# Altium schematic sheet 917S001(ZHTH-010)-F.SchDoc
size A3; PageSetup: Record=PageOptions|CenterHorizontal=True|CenterVertical=True|PrintScale=0.71|XCorrection=1.00|YCorrection=1.00|PrintKind=1|BorderSize=5000000|LeftOffset=0|BottomOffset=0|Orientation=2|PaperLength=1000|PaperWidth=1000|Scale=100|PaperSource=7|PrintQuality=300|MediaType=1|DitherType=10|PrintScaleMode=1|PaperKind=A4(210x297mm)
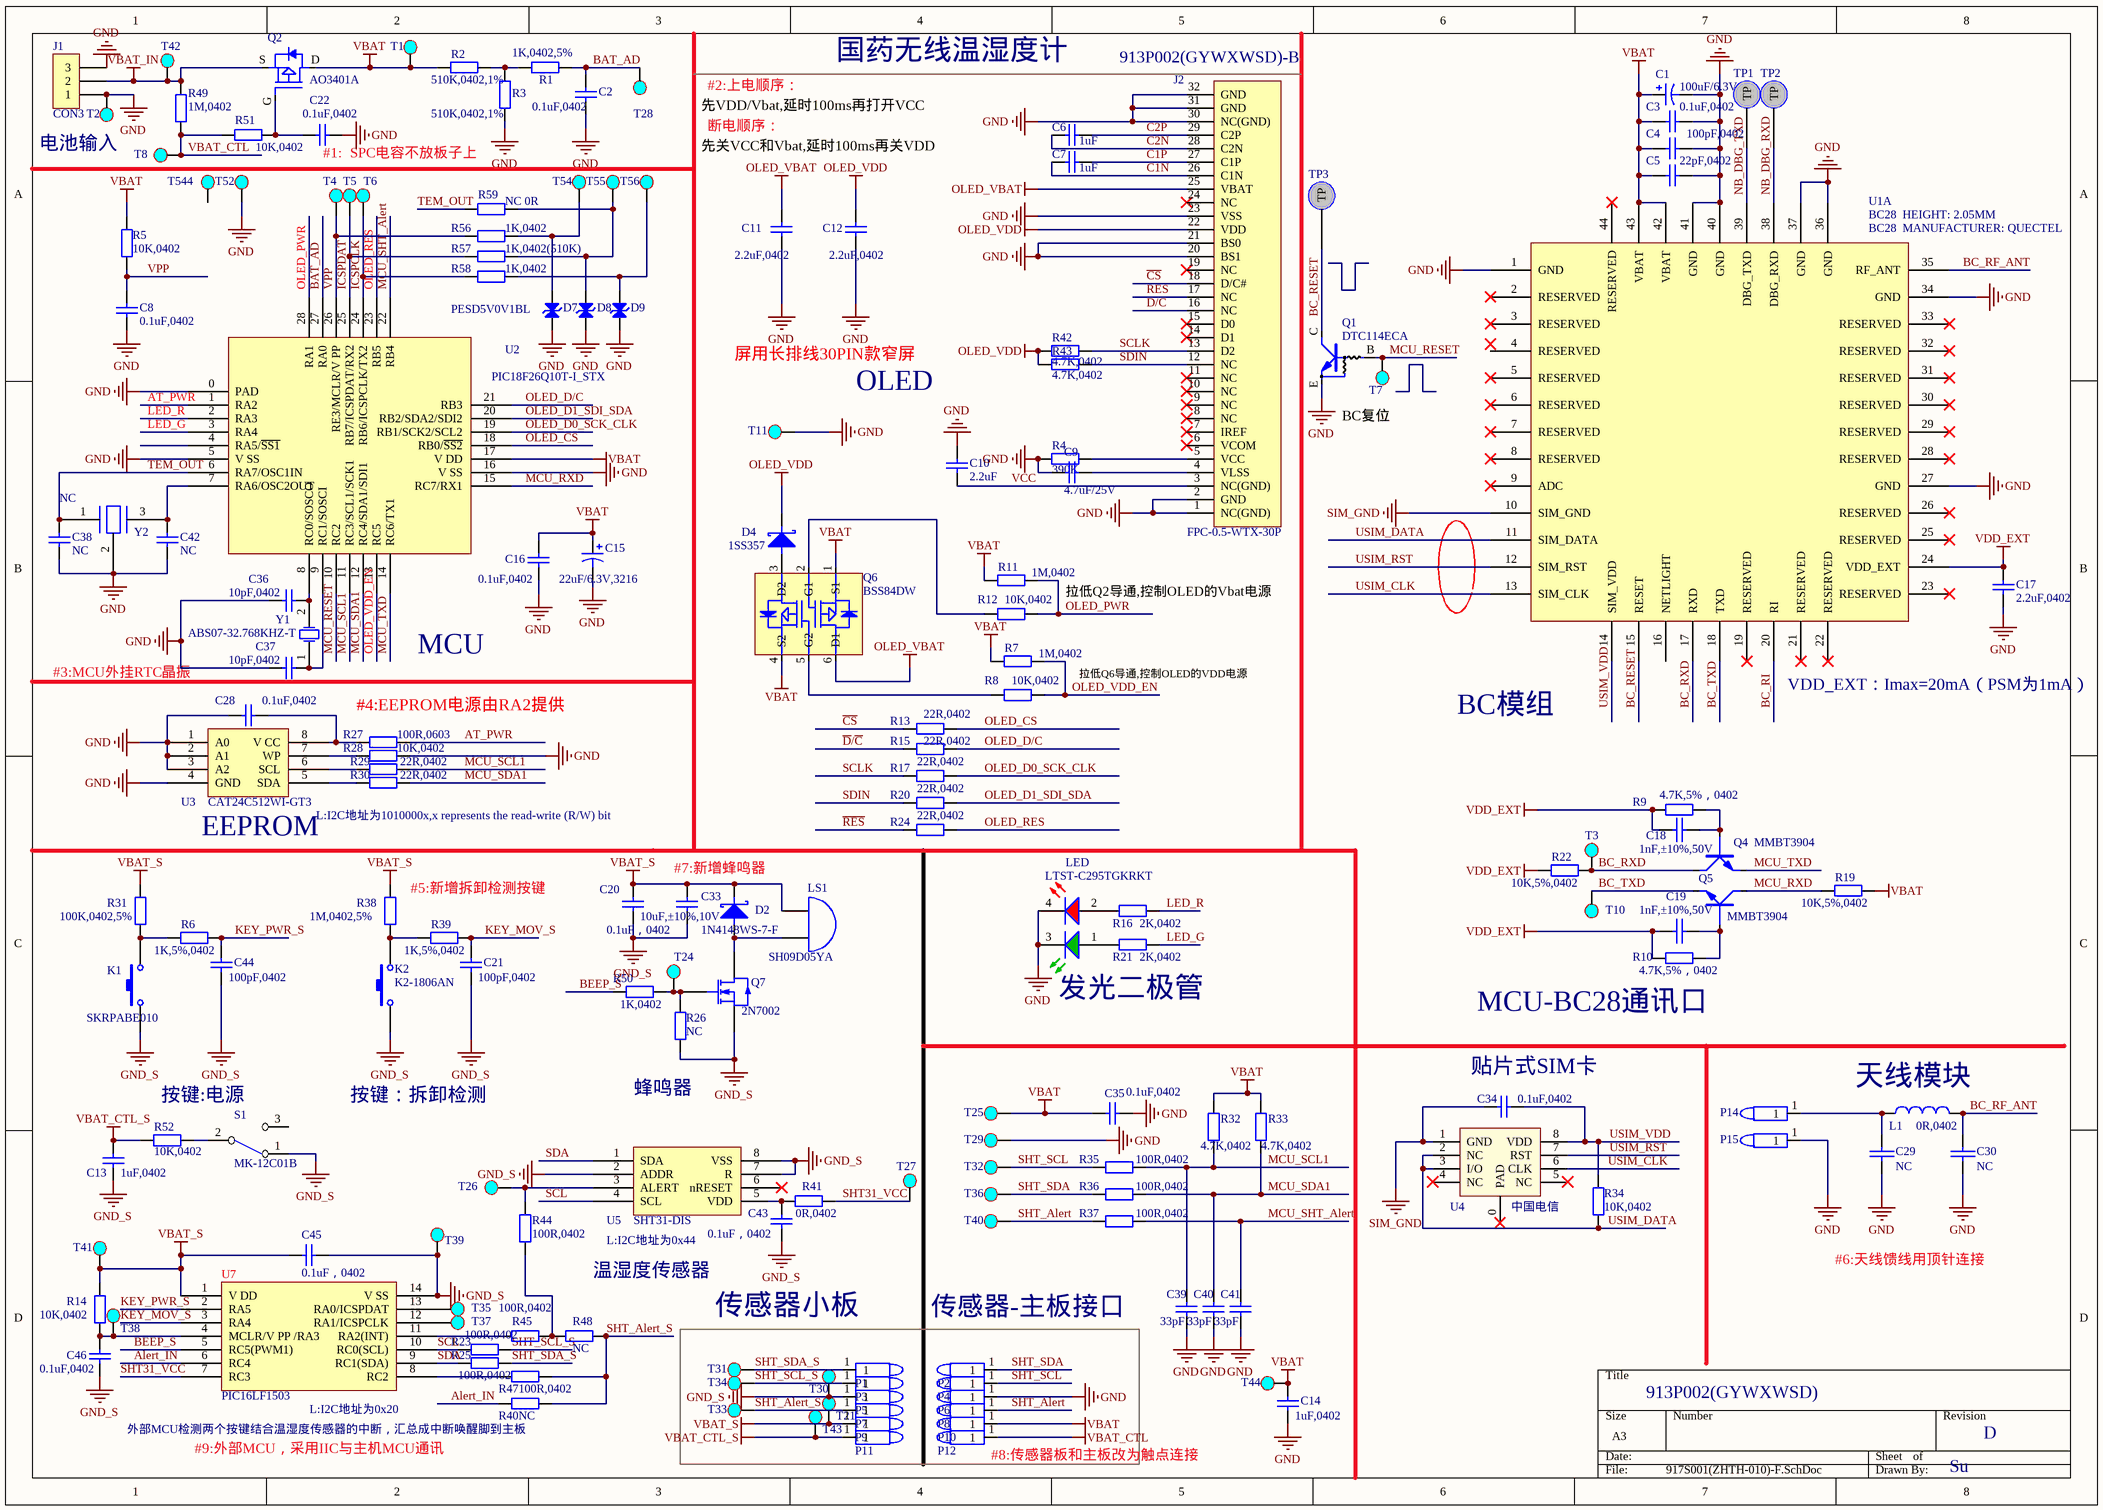
[diagram p0: 917S001(ZHTH-010)-F.SchDoc]

## Parts
C1  100uF/6.3V  [3528]
C2  0.1uF,0402  [0402]
C3  0.1uF,0402  [0402]
C4  100pF,0402  [0402]
C5  22pF,0402  [0402]
C6  1uF  [0402]
C7  1uF  [0402]
C8  0.1uF,0402  [0402]
C9  4.7uF/25V  [0805]
C10  2.2uF  [0402]
C11  2.2uF,0402  [0402]
C12  2.2uF,0402  [0402]
C13  1uF,0402  [0402]
C14  1uF,0402  [0402]
C15  22uF/6.3V,3216  [3216]
C16  0.1uF,0402  [0402]
C17  2.2uF,0402  [0402]
C18  1nF,±10%,50V  [0402]
C19  1nF,±10%,50V  [0402]
C20  0.1uF，0402  [0402]
C21  100pF,0402  [0402]
C22  0.1uF,0402  [0402]
C28  0.1uF,0402  [0402]
C29  NC  [0402]
C30  NC  [0402]
C33  10uF,±10%,10V  [0805]
C34  0.1uF,0402  [0402]
C35  0.1uF,0402  [0402]
C36  10pF,0402  [0402]
C37  10pF,0402  [0402]
C38  NC  [0402]
C39  33pF  [0402]
C40  33pF  [0402]
C41  33pF  [0402]
C42  NC  [0402]
C43  0.1uF，0402  [0402]
C44  100pF,0402  [0402]
C45  0.1uF，0402  [0402]
C46  0.1uF,0402  [0402]
D2  1N4148WS-7-F  [SOD-323]
D4  1SS357  [SOD-323]
D7  PESD5V0V1BL  [DFN1006]
D8  PESD5V0V1BL  [DFN1006]  (value not drawn)
D9  PESD5V0V1BL  [DFN1006]  (value not drawn)
J1  CON3  [JVT1125W4T-02SN-S]
J2  FPC-0.5-WTX-30P  [FPC-wo-0.5-30 - f]
K1  SKRPABE010  [SKRPABE010]
K2  K2-1806AN  [K2-1806AN]
L1  0R,0402  [0402]
LED  LTST-C295TGKRKT  [LTST-295T]
LS1  SH09D05YA  [SH09D05YA]
P1  TZ-650B01  [POGOPAD]  (value not drawn)
P2  TZ-650B01  [POGOPAD]  (value not drawn)
P3  TZ-650B01  [POGOPAD]  (value not drawn)
P4  TZ-650B01  [POGOPAD]  (value not drawn)
P5  TZ-650B01  [POGOPAD]  (value not drawn)
P6  TZ-650B01  [POGOPAD]  (value not drawn)
P7  TZ-650B01  [POGOPAD]  (value not drawn)
P8  TZ-650B01  [POGOPAD]  (value not drawn)
P9  TZ-650B01  [POGOPAD]  (value not drawn)
P10  TZ-650B01  [POGOPAD]  (value not drawn)
P11  TZ-650B01  [POGOPAD]  (value not drawn)
P12  TZ-650B01  [POGOPAD]  (value not drawn)
P14  TZ-650B01  [POGOPAD]  (value not drawn)
P15  TZ-650B01  [POGOPAD]  (value not drawn)
Q1  DTC114ECA  [SOT-23(BEC)]
Q2  AO3401A  [SOT-23 (GSD)-L]
Q4  MMBT3904  [SOT-23(BEC)]
Q5  MMBT3904  [SOT-23(BEC)]
Q6  BSS84DW  [SOT-363]
Q7  2N7002  [SOT-23]
R1  1K,0402,5%  [0402]
R2  510K,0402,1%  [0402]
R3  510K,0402,1%  [0402]
R4  390K  [0603]
R5  10K,0402  [0402]
R6  1K,5%,0402  [0402]
R7  1M,0402  [0402]
R8  10K,0402  [0402]
R9  4.7K,5%，0402  [0402]
R10  4.7K,5%，0402  [0402]
R11  1M,0402  [0402]
R12  10K,0402  [0402]
R13  22R,0402  [0402]
R14  10K,0402  [0402]
R15  22R,0402  [0402]
R16  2K,0402  [0402]
R17  22R,0402  [0402]
R19  10K,5%,0402  [0402]
R20  22R,0402  [0402]
R21  2K,0402  [0402]
R22  10K,5%,0402  [0402]
R23  100R,0402  [0402]
R24  22R,0402  [0402]
R25  100R,0402  [0402]
R26  NC  [0402]
R27  100R,0603  [0402]
R28  10K,0402  [0402]
R29  22R,0402  [0402]
R30  22R,0402  [0402]
R31  100K,0402,5%  [0402]
R32  4.7K,0402  [0402]
R33  4.7K,0402  [0402]
R34  10K,0402  [0402]
R35  100R,0402  [0402]
R36  100R,0402  [0402]
R37  100R,0402  [0402]
R38  1M,0402,5%  [0402]
R39  1K,5%,0402  [0402]
R40  NC  [0402]
R41  0R,0402  [0402]
R42  4.7K,0402  [0402]
R43  4.7K,0402  [0402]
R44  100R,0402  [0402]
R45  100R,0402  [0402]
R47  100R,0402  [0402]
R48  NC  [0402]
R49  1M,0402  [0402]
R50  1K,0402  [0402]
R51  10K,0402  [0402]
R52  10K,0402  [0402]
R56  1K,0402  [0402]
R57  1K,0402(510K)  [0402]
R58  1K,0402  [0402]
R59  NC 0R  [0402]
S1  MK-12C01B  [K3-1293S]
T1  TestPoints  [TestPoints]  (value not drawn)
T2  TestPoints  [TestPoints]  (value not drawn)
T3  TestPoints  [TestPoints-1.5]  (value not drawn)
T4  TestPoints  [TestPoints]  (value not drawn)
T5  TestPoints  [TestPoints]  (value not drawn)
T6  TestPoints  [TestPoints]  (value not drawn)
T7  TestPoints  [TestPoints-1.5]  (value not drawn)
T8  TestPoints  [TestPoints]  (value not drawn)
T10  TestPoints  [TestPoints-1.5]  (value not drawn)
T11  TestPoints  [TestPoints-1.5]  (value not drawn)
T21  TestPoints  [TestPoints-1.5]  (value not drawn)
T24  TestPoints  [TestPoints-1.5]  (value not drawn)
T25  TestPoints  [TestPoints-1.5]  (value not drawn)
T26  TestPoints  [TestPoints-1.5]  (value not drawn)
T27  TestPoints  [TestPoints-1.5]  (value not drawn)
T28  TestPoints  [TestPoints-1.5]  (value not drawn)
T29  TestPoints  [TestPoints-1.5]  (value not drawn)
T30  TestPoints  [TestPoints-1.5]  (value not drawn)
T31  TestPoints  [TestPoints-1.5]  (value not drawn)
T32  TestPoints  [TestPoints-1.5]  (value not drawn)
T33  TestPoints  [TestPoints-1.5]  (value not drawn)
T34  TestPoints  [TestPoints-1.5]  (value not drawn)
T35  TestPoints  [TestPoints-1.5]  (value not drawn)
T36  TestPoints  [TestPoints-1.5]  (value not drawn)
T37  TestPoints  [TestPoints-1.5]  (value not drawn)
T38  TestPoints  [TestPoints-1.5]  (value not drawn)
T39  TestPoints  [TestPoints-1.5]  (value not drawn)
T40  TestPoints  [TestPoints-1.5]  (value not drawn)
T41  TestPoints  [TestPoints-1.5]  (value not drawn)
T42  TestPoints  [TestPoints]  (value not drawn)
T43  TestPoints  [TestPoints-1.5]  (value not drawn)
T44  TestPoints  [TestPoints-1.5]  (value not drawn)
T52  TestPoints  [TestPoints]  (value not drawn)
T54  TestPoints  [TestPoints]  (value not drawn)
T55  TestPoints  [TestPoints]  (value not drawn)
T56  TestPoints  [TestPoints]  (value not drawn)
T544  TestPoints  [TestPoints]  (value not drawn)
TP1  TP1  [TestPoints-1.5]  (value not drawn)
TP2  TP2  [TestPoints-1.5]  (value not drawn)
TP3  TP2  [TestPoints-1.5]  (value not drawn)
U1  BC28  HEIGHT: 2.05MM  MANUFACTURER: QUECTEL  [BC28]  (part A of 2)
U2  PIC18F26Q10T-I_STX  [UQFN28(4x4)]
U3  CAT24C512WI-GT3  [SO8]
U4  中国电信  [SMT_CARD]
U5  SHT31-DIS  [DFN-8(2.5X2.5)]
U7  PIC16LF1503  [SO14]
Y1  ABS07-32.768KHZ-T  [XTAL3215]
Y2  NC  [Y3215]

## Blocks framed on the sheet
传感器小板: P1-P12 T21 T30 T31 T33 T34 T43

## Nets
GND: C1.2 C2.2 C3.2 C4.2 C5.2 C8.2 C9.2 C10.2 C11.1 C12.1 C14.1 C15.2 C16.2 C17.1 C22.2 C28.2 C29.1 C30.1 C35.2 C36.1 C37.1 C38.2 C39.1 C40.1 C41.1 C42.2 D7.1 D8.1 D9.1 J1.1 J1.3 J2.1(NC(GND)) J2.2(GND) J2.20(BS1) J2.21(BS0) J2.23(VSS) J2.30(NC(GND)) J2.31(GND) J2.32(GND) LED.3(K) LED.4(K) P6.1 P15.1 Q1.E(e) R3.2 R4.2 R28.2 T2.1 T11.1 T29.1 T52.1 U1.1(GND) U1.27(GND) U1.34(GND) U1.36(GND) U1.37(GND) U1.40(GND) U1.41(GND) U2.0(PAD) U2.5(V_SS) U2.16(V_SS) U3.1(A0) U3.2(A1) U3.3(A2) U3.4(GND) Y2.2
GND_S: C13.1 C20.2 C21.1 C33.2 C43.2 C44.1 C45.2 C46.2 K1.2 K2.1 P5.1 Q7.2(S) R26.2 S1.1(NO) T30.1 T39.1 U5.2(ADDR) U5.7(R) U5.8(VSS) U7.14(V_SS)
OLED_VBAT: C11.2 J2.25(VBAT) Q6.6(D1)
OLED_VDD: C12.2 D4.2(K) J2.22(VDD) R42.1 R43.1
SIM_GND: C34.2 U1.10(SIM_GND) U4.1(GND)
VBAT: C1.1 C3.1 C4.1 C5.1 C14.2 C15.1 C16.1 C35.1 P10.1 Q2.D Q6.1(S1) Q6.4(S2) R2.2 R5.2 R7.2 R11.2 R19.1 R32.1 R33.1 T1.1 T25.1 T44.1 U1.42(VBAT) U1.43(VBAT) U2.17(V_DD)
VBAT_CTL: P12.1 R49.1 R51.1 T8.1
VBAT_CTL_S: C13.2 P11.1 R52.2 T43.1
VBAT_IN: J1.2 Q2.S R49.2 T42.1
VBAT_S: C20.1 C33.1 C45.1 D2.2(K) LS1.1(A) P9.1 R14.1 R31.1 R38.1 T21.1 T41.1 U7.1(V_DD)
VDD_EXT: C17.2 C18.2 C19.2 R9.2 R10.1 R22.2 U1.24(VDD_EXT)
Alert_IN: R40.1 U7.6(RC4)
AT_PWR: R27.1 U2.1(RA2)
BAT_AD: C2.1 R1.1 T28.1 U2.27(RA0)
BC_RESET: Q1.C(c) TP3.1(TP) U1.15(RESET)
BC_RF_ANT: C30.2 L1.2 U1.35(RF_ANT)
BC_RI: U1.20(RI)
BC_RXD: Q4.C(c) R22.1 T3.1 U1.17(RXD)
BC_TXD: Q5.E(e) T10.1 U1.18(TXD)
BEEP_S: R50.2 U7.5(RC5(PWM1))
C1N: C7.2 J2.26(C1N)
C1P: C7.1 J2.27(C1P)
C2N: C6.2 J2.28(C2N)
C2P: C6.1 J2.29(C2P)
~{CS}: J2.18(D/C#) R13.1
~{D}/~{C}: J2.16(NC) R15.1
ICSPCLK: R58.1 T6.1 U2.24(RB6/ICSPCLK/TX2)
ICSPDAT: R57.1 T5.1 U2.25(RB7/ICSPDAT/RX2)
KEY_MOV_S: C21.2 R39.2 U7.3(RA4)
KEY_PWR_S: C44.2 R6.2 U7.2(RA5)
LED_G: R21.2 U2.3(RA4)
LED_R: R16.2 U2.2(RA3)
MCU_RESET: Q1.B(b) T7.1 U2.10(RC2)
MCU_RXD: Q5.C(c) R19.2 U2.15(RC7/RX1)
MCU_SCL1: C39.2 R29.2 R32.2 R35.2 U2.11(RC3/SCL1/SCK1)
MCU_SDA1: C40.2 R30.2 R33.2 R36.2 U2.12(RC4/SDA1/SDI1)
MCU_SHT_Alert: C41.2 R37.2 U2.22(RB4)
MCU_TXD: Q4.E(e) U2.14(RC6/TX1)
NB_DBG_RXD: TP2.1(TP) U1.38(DBG_RXD)
NB_DBG_TXD: TP1.1(TP) U1.39(DBG_TXD)
OLED_CS: R13.2 U2.18(RB0/~{SS2})
OLED_D0_SCK_CLK: R17.2 U2.19(RB1/SCK2/SCL2)
OLED_D1_SDI_SDA: R20.2 U2.20(RB2/SDA2/SDI2)
OLED_D/C: R15.2 U2.21(RB3)
OLED_PWR: R11.1 R12.2 U2.28(RA1)
OLED_RES: R24.2 U2.23(RB5)
OLED_VDD_EN: R7.1 R8.2 U2.13(RC5)
~{RES}: J2.17(NC) R24.1
SCL: R23.1 U5.4(SCL) U7.10(RC0(SCL))
SCLK: J2.13(D2) R17.1 R42.2
SDA: R25.1 U5.1(SDA) U7.9(RC1(SDA))
SDIN: J2.12(NC) R20.1 R43.2
SHT31_VCC: R41.2 T27.1 U7.7(RC3)
SHT_Alert: P8.1 R37.1 T40.1
SHT_Alert_S: P7.1 R40.2 R47.2 R48.2 T33.1
SHT_SCL: P4.1 R35.1 T32.1
SHT_SCL_S: P3.1 R23.2 T34.1
SHT_SDA: P2.1 R36.1 T36.1
SHT_SDA_S: P1.1 R25.2 T31.1
TEM_OUT: C38.1 R59.1 U2.6(RA7/OSC1IN) Y2.1
USIM_CLK: U1.13(SIM_CLK) U4.6(CLK)
USIM_DATA: R34.1 U1.11(SIM_DATA) U4.2(NC) U4.3(I/O)
USIM_RST: U1.12(SIM_RST) U4.7(RST)
USIM_VDD: C34.1 R34.2 U1.14(SIM_VDD) U4.8(VDD)
VCC: C10.1 J2.3(NC(GND))
VPP: C8.1 R5.1 R56.1 T4.1 U2.26(RE3/MCLR/V_PP)
NetC9_1: C9.1 J2.4(VLSS)
NetC18_1: C18.1 Q4.B(b) R9.1
NetC19_1: C19.1 Q5.B(b) R10.2
NetC22_1: C22.1 Q2.G R51.2
NetC28_1: C28.1 R27.2 U3.8(V_CC)
NetC29_2: C29.2 L1.1 P14.1
NetC36_2: C36.2 U2.8(RC0/SOSCO) Y1.2(OSC2)
NetC37_2: C37.2 U2.9(RC1/SOSCI) Y1.1(OSC1)
NetC42_1: C42.1 U2.7(RA6/OSC2OUT) Y2.3
NetC43_1: C43.1 R41.1 U5.5(VDD)
NetC46_1: C46.1 R14.2 T38.1 U7.4(MCLR/V_PP_/RA3)
NetD2_1: D2.1(A) LS1.2(B) Q7.3(D)
NetD4_1: D4.1(A) Q6.3(D2)
NetD7_2: D7.2 R56.2 T54.1
NetD8_2: D8.2 R57.2 R59.2 T55.1
NetD9_2: D9.2 R58.2 T56.1
NetJ2_5: J2.5(VCC) R4.1
NetK1_1: K1.1 R6.1 R31.2
NetK2_2: K2.2 R38.2 R39.1
NetLED_1: LED.1(A) R21.1
NetLED_2: LED.2(A) R16.1
NetQ6_2: Q6.2(G1) R12.1
NetQ6_5: Q6.5(G2) R8.1
NetQ7_1: Q7.1(G) R26.1 R50.1 T24.1
NetR1_2: R1.2 R2.1 R3.1
NetR28_1: R28.1 U3.7(WP)
NetR29_1: R29.1 U3.6(SCL)
NetR30_1: R30.1 U3.5(SDA)
NetR44_1: R44.1 R45.2 R48.1
NetR44_2: R44.2 T26.1 U5.3(ALERT)
NetR45_1: R45.1 U7.11(RA2(INT))
NetR47_1: R47.1 U7.8(RC2)
NetR52_1: R52.1 S1.2(COMMON)
NetT35_1: T35.1 U7.13(RA0/ICSPDAT)
NetT37_1: T37.1 U7.12(RA1/ICSPCLK)

Not connected (* = marked no-connect by the designer): J2 6(VCOM)* 7(IREF)* 8(NC)* 9(NC)* 10(NC)* 11(NC)* 14(D1)* 15(D0)* 19(NC)* 24(NC)*; S1 3(NO); T544 1; U1 2(RESERVED)* 3(RESERVED)* 4(RESERVED) 5(RESERVED)* 6(RESERVED)* 7(RESERVED)* 8(RESERVED)* 9(ADC)* 16(NETLIGHT) 19(RESERVED)* 21(RESERVED)* 22(RESERVED)* 23(RESERVED)* 25(RESERVED)* 26(RESERVED)* 28(RESERVED)* 29(RESERVED)* 30(RESERVED)* 31(RESERVED)* 32(RESERVED)* 33(RESERVED)* 44(RESERVED)*; U2 4(RA5/~{SS1}); U3 9(GND); U4 0(PAD)* 4(NC)* 5(NC)*; U5 6(nRESET)* 9(VSS)

## Notes on the sheet
- 先VDD/Vbat,延时100ms再打开VCC
- #2:上电顺序：
- 国药无线温湿度计
- (near J2) 913P002(GYWXWSD)-B
- 电池输入
- (near C22) #1:
- (near C22) SPC电容不放板子上
- 先关VCC和Vbat,延时100ms再关VDD
- 断电顺序：
- 屏用长排线30PIN款窄屏
- OLED
- BC复位
- 拉低Q2导通,控制OLED的Vbat电源
- #3:MCU外挂RTC晶振
- #4:EEPROM电源由RA2提供
- MCU
- 拉低Q6导通,控制OLED的VDD电源
- BC模组
- VDD_EXT：Imax=20mA（PSM为1mA）
- (near U3) EEPROM
- L:I2C地址为1010000x,x represents the read-write (R/W) bit
- (near R38) #5:新增拆卸检测按键
- #7:新增蜂鸣器
- 发光二极管
- (near R10) MCU-BC28通讯口
- 按键:电源
- 按键：拆卸检测
- 蜂鸣器
- (near C34) 贴片式SIM卡
- (near L1) 天线模块
- (near U5) L:I2C地址为0x44
- #6:天线馈线用顶针连接
- 温湿度传感器
- 传感器-主板接口
- 913P002(GYWXWSD)
- 外部MCU检测两个按键结合温湿度传感器的中断，汇总成中断唤醒脚到主板
- #9:外部MCU，采用IIC与主机MCU通讯
- (near U7) L:I2C地址为0x20
- (near P12) #8:传感器板和主板改为触点连接
- D
- Su

## Library data of the parts
C1 C15 = Cap Pol2: Polarized Capacitor (Axial); Published: 8-Jun-2000; LatestRevisionDate: 17-Jul-2002; LatestRevisionNote: Re-released for DXP Platform.; PackageReference: POLAR0.8; Publisher: Altium Limited
C2 C3 C8 C16 C20 C22 C28 C35-C38 C42 C43 C45 C46 = Cap: Capacitor; Value: 100nF; Published: 8-Jun-2000; LatestRevisionDate: 17-Jul-2002; LatestRevisionNote: Re-released for DXP Platform.; PackageReference: RAD-0.3; Publisher: Altium Limited
C4 C5 C34 C39-C41 = Cap: Capacitor; Published: 8-Jun-2000; LatestRevisionDate: 17-Jul-2002; LatestRevisionNote: Re-released for DXP Platform.; PackageReference: RAD-0.3; Publisher: Altium Limited
  C4: Value: 100pF
  C5: Value: 22pF
  C34: Value: 0.1uF; OK: OK
  C39-C41: Value: 33pF
C6 C7 = Cap: Capacitor; Value: 1uF/25V; 物料编码: 7204-1003-00210
C9-C12 = Cap: Capacitor; Value: 2.2uF/25V; 物料编码: 7204-1002-01280
C13 C14 C21 C44 = Cap: Capacitor; 编码: 6204-1002-01270; 规格: YAGEO,CC0402KRX7R9BB103,X7R,0.01uF,±10%,50V
C17 = Cap: Capacitor; 编码: 7204-1002-01390; Published: 8-Jun-2000; LatestRevisionDate: 17-Jul-2002; LatestRevisionNote: Re-released for DXP Platform.; PackageReference: RAD-0.3; Publisher: Altium Limited
C18 C19 = Cap: Capacitor; Manufacturer: Generic Components; Class: Passive; Value: NC; Published: 08/06/2000; Publisher: Altium Hobart Technology Centre; SubClass: Capacitor
C29 C30 = Cap: Capacitor; Manufacturer: Generic Components; Class: Passive; Published: 08/06/2000; Publisher: Altium Hobart Technology Centre; SubClass: Capacitor; Value: NC
C33 = Cap: Capacitor; 物料编码: 6204-1004-00620; Value: 10uF,±10%,10V
D2 D4 = DIODE SCHOTTKY: Schottky Diode; 物料编码: 4204-3204-02210
D7-D9 = DIODE TVS: TVS管
J1 = CON3: Connector
J2 = Header 32-2
K1 K2 = SW-PB: Switch; Published: 24-Mar-1999; LatestRevisionDate: 17-Jul-2002; LatestRevisionNote: Re-released for DXP Platform.; PackageReference: SPST-2; Publisher: Altium Limited
L1 = Inductor: Code_IEC: 1005; Value: UPZ1005D600-1R5TF; Published: 8-Jun-2000; LatestRevisionDate: 29-May-2009; LatestRevisionNote: IPC-7351 Footprint Added.; PackageReference: 0402-A; Publisher: Altium Limited; PackageDescription: Chip Inductor; Code_JEITA: 0402
LS1 = Bell: Electrical Bell; Published: 24-Mar-1999; LatestRevisionDate: 17-Jul-2002; LatestRevisionNote: Re-released for DXP Platform.; PackageReference: PIN2; Publisher: Altium Limited
P1-P12 P14 P15 = POGOPIN
Q1 = PDTC114ET: 三极管
Q2 = MOS P: MOSFET; 物料编码: 4204-3801-02030
Q4 Q5 = NPN: 三极管
Q6 = MOS D-P(SOT363): MOSFET
Q7 = N-MOSFET
R1 = Res2: Resistor; Value: 100R; Published: 8-Jun-2000; LatestRevisionDate: 17-Jul-2002; LatestRevisionNote: Re-released for DXP Platform.; PackageReference: AXIAL-0.4; Publisher: Altium Limited; PackageDescription: Axial Device, Thru-Hole; 2 Leads; 0.4 in Pin Spacing
R2 R3 R5 R7 R11 R14 R16 R21 R23 R25-R28 R40 R41 R44 R45 R47-R50 R52 = Res2: Resistor; Value: 20K; Published: 8-Jun-2000; LatestRevisionDate: 17-Jul-2002; LatestRevisionNote: Re-released for DXP Platform.; PackageReference: AXIAL-0.4; Publisher: Altium Limited; PackageDescription: Axial Device, Thru-Hole; 2 Leads; 0.4 in Pin Spacing
R4 = Res2: Resistor; Value: 390K,0603; 物料编码: 6204-0203-06690
R6 R13 R15 R17 R20 R24 R29-R31 R34 R38 R39 R56-R58 = Res2: Resistor
  R6 R39 R56-R58: Published: 8-Jun-2000; LatestRevisionDate: 17-Jul-2002; LatestRevisionNote: Re-released for DXP Platform.; PackageReference: AXIAL-0.4; Publisher: Altium Limited; PackageDescription: Axial Device, Thru-Hole; 2 Leads; 0.4 in Pin Spacing; Value: 1K
  R13 R15 R17 R20 R24 R29 R30: Published: 8-Jun-2000; LatestRevisionDate: 17-Jul-2002; LatestRevisionNote: Re-released for DXP Platform.; PackageReference: AXIAL-0.4; Publisher: Altium Limited; PackageDescription: Axial Device, Thru-Hole; 2 Leads; 0.4 in Pin Spacing; Value: 22R
  R34: Published: 8-Jun-2000; LatestRevisionDate: 17-Jul-2002; LatestRevisionNote: Re-released for DXP Platform.; PackageReference: AXIAL-0.4; Publisher: Altium Limited
R8 R12 R35-R37 R51 = Res2: Resistor; Value: 22R; Published: 8-Jun-2000; LatestRevisionDate: 17-Jul-2002; LatestRevisionNote: Re-released for DXP Platform.; PackageReference: AXIAL-0.4; Publisher: Altium Limited; PackageDescription: Axial Device, Thru-Hole; 2 Leads; 0.4 in Pin Spacing
R9 R10 R19 R22 = Res2: Resistor; Value: 0R; Published: 8-Jun-2000; LatestRevisionDate: 17-Jul-2002; LatestRevisionNote: Re-released for DXP Platform.; PackageReference: AXIAL-0.4; Publisher: Altium Limited; PackageDescription: Axial Device, Thru-Hole; 2 Leads; 0.4 in Pin Spacing
R32 R33 R42 R43 = Res2: Resistor; Value: 47K; Published: 8-Jun-2000; LatestRevisionDate: 17-Jul-2002; LatestRevisionNote: Re-released for DXP Platform.; PackageReference: AXIAL-0.4; Publisher: Altium Limited; PackageDescription: Axial Device, Thru-Hole; 2 Leads; 0.4 in Pin Spacing
R59 = Res2: Resistor; Value: 1K; Published: 8-Jun-2000; LatestRevisionDate: 17-Jul-2002; LatestRevisionNote: Re-released for DXP Platform.; PackageReference: AXIAL-0.4; Publisher: Altium Limited; PackageDescription: Axial Device, Thru-Hole; 2 Leads; 0.4 in Pin Spacing
S1 = SW SPDT: 拨动开关
TP1-TP3 = Component_2
U2 = PIC16F15356
U3 = AT24C32D
U4 = QUAD_EUICC
U5 = SHT35
Y1 = XTAL: Crystal Oscillator; 编码: 4204-4001-00430
Y2 = CSTCE12M00G52-RO: Value: 8MHz; 物料编码: 4204-4001-00550; Type: CSTNE8M00G550000R0
U1 = BC28: VALUE: BC28